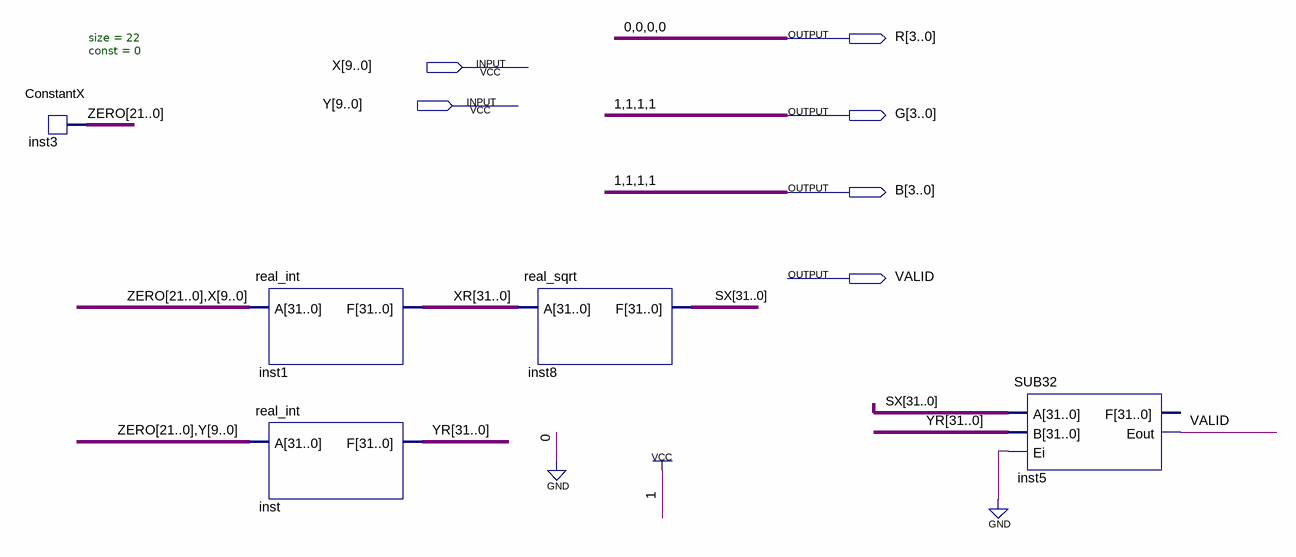
[diagram p0: schematic sheet]
// Quartus schematic Layer_sqrt.bdf as structural Verilog: 5 symbols, 6 pins
module Layer_sqrt (
  input  [9:0] X,
  input  [9:0] Y,
  output [3:0] R,
  output [3:0] G,
  output [3:0] B,
  output VALID
);

  wire [21:0] ZERO;
  wire [31:0] SX, XR, YR;

  ConstantX #(.size(22), .\const (0)) inst3 (.DATA_OUT(ZERO));
  real_int inst1 (.A({ZERO, X}), .F(XR));
  real_int inst (.A({ZERO, Y}), .F(YR));
  real_sqrt inst8 (.A(XR), .F(SX));
  SUB32 inst5 (.A(SX), .B(YR), .Ei(1'b0), .Eout(VALID));  // open: F

  assign B = 4'b1111;
  assign G = 4'b1111;
  assign R = 4'b0000;
endmodule
